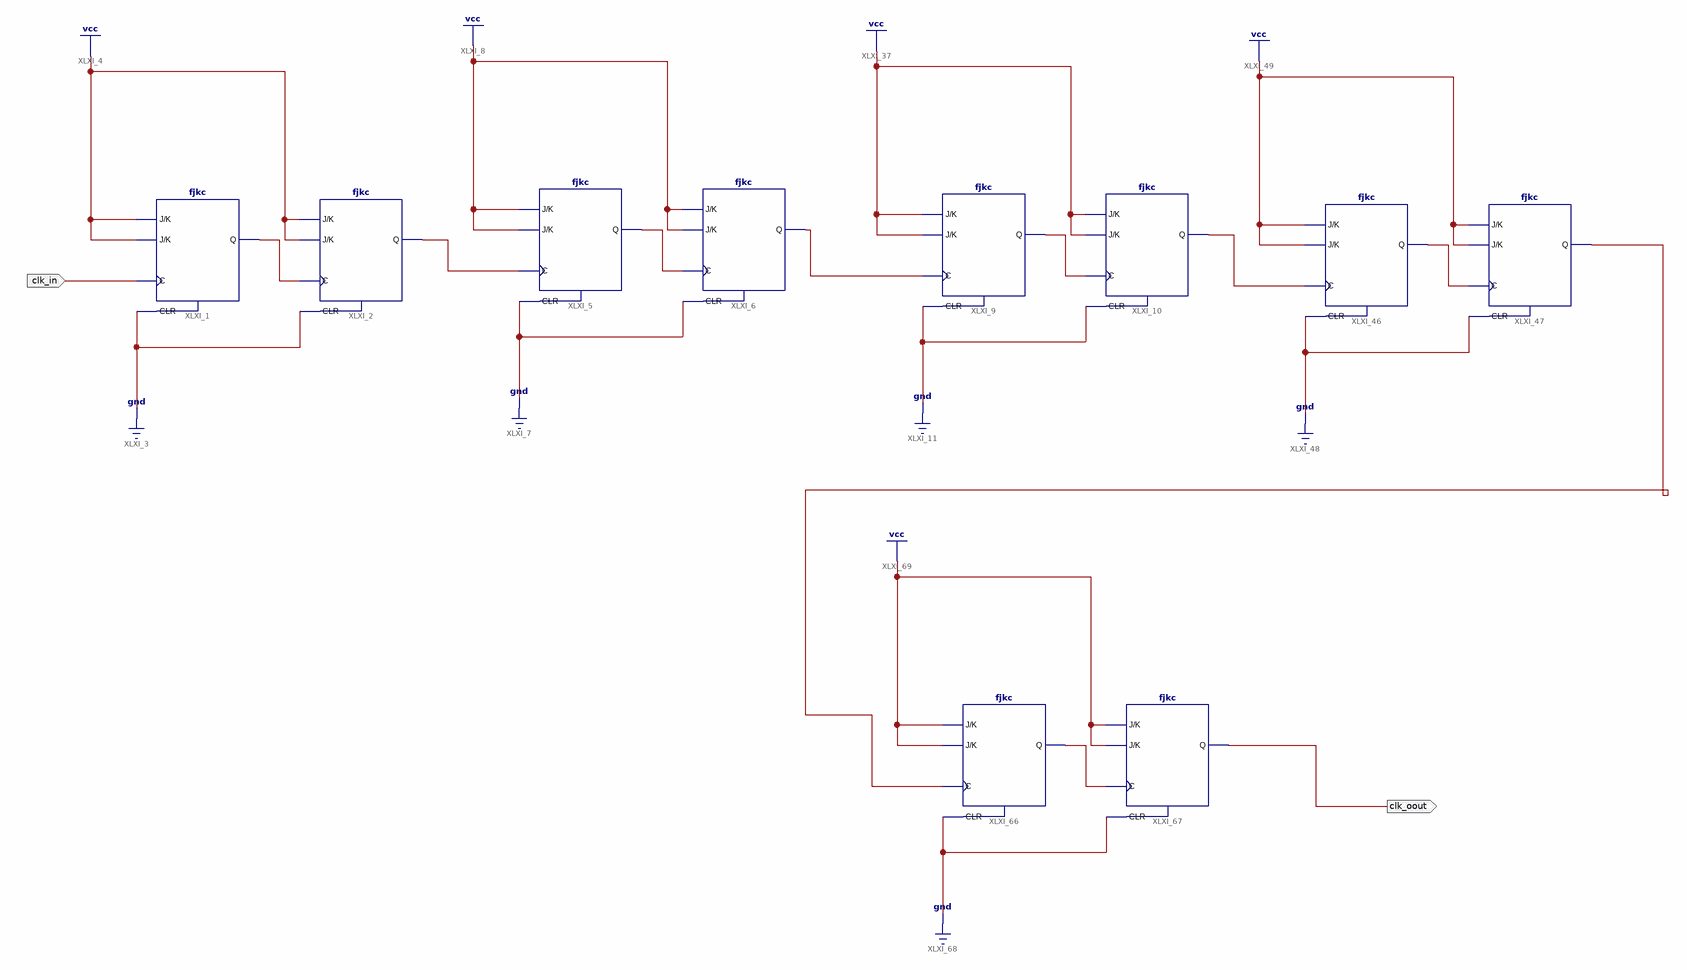
[diagram p0: schematic sheet 1]
// Xilinx ISE schematic clk_210.sch (spartan6) as structural Verilog: 10 symbols, 2 ports
module clk_210 (
  input  clk_in,
  output clk_oout
);

  wire clk_out, XLXN_3, XLXN_6, XLXN_49, XLXN_50, XLXN_62, XLXN_63, XLXN_83, XLXN_87;

  fjkc XLXI_1 (.C(clk_in), .CLR(1'b0), .J(1'b1), .K(1'b1), .Q(XLXN_3));
  fjkc XLXI_2 (.C(XLXN_3), .CLR(1'b0), .J(1'b1), .K(1'b1), .Q(clk_out));
  fjkc XLXI_5 (.C(clk_out), .CLR(1'b0), .J(1'b1), .K(1'b1), .Q(XLXN_6));
  fjkc XLXI_6 (.C(XLXN_6), .CLR(1'b0), .J(1'b1), .K(1'b1), .Q(XLXN_49));
  fjkc XLXI_9 (.C(XLXN_49), .CLR(1'b0), .J(1'b1), .K(1'b1), .Q(XLXN_50));
  fjkc XLXI_10 (.C(XLXN_50), .CLR(1'b0), .J(1'b1), .K(1'b1), .Q(XLXN_62));
  fjkc XLXI_46 (.C(XLXN_62), .CLR(1'b0), .J(1'b1), .K(1'b1), .Q(XLXN_63));
  fjkc XLXI_47 (.C(XLXN_63), .CLR(1'b0), .J(1'b1), .K(1'b1), .Q(XLXN_87));
  fjkc XLXI_66 (.C(XLXN_87), .CLR(1'b0), .J(1'b1), .K(1'b1), .Q(XLXN_83));
  fjkc XLXI_67 (.C(XLXN_83), .CLR(1'b0), .J(1'b1), .K(1'b1), .Q(clk_oout));
endmodule
